# Altium schematic sheet RS232.SchDoc
size A4
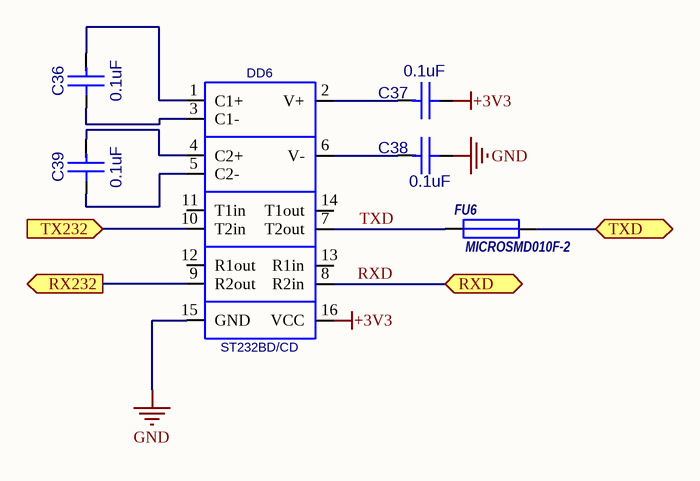
[diagram p0: RS232.SchDoc]

## Parts
C36  0.1uF  [CC0603]
C37  0.1uF  [CC0603]
C38  0.1uF  [CC0603]
C39  0.1uF  [CC0603]
DD6  ST232BD/CD  [SO16_M]
FU6  MICROSMD010F-2  [RC1210]

## Ports
RX232 (out), RXD, TX232 (in), TXD

## Nets
+3V3: C37.1(A) DD6.16(VCC)
GND: C38.1(A) DD6.15(GND)
RX232: DD6.9(R2out) ; port RX232
RXD: DD6.8(R2in) ; port RXD
TX232: DD6.10(T2in) ; port TX232
TXD: DD6.7(T2out) FU6.1
TXD: FU6.2 ; port TXD  [a separate net that carries the same name]
NetC36_1: C36.1(A) DD6.3(C1-)
NetC36_2: C36.2(B) DD6.1(C1+)
NetC37_2: C37.2(B) DD6.2(V+)
NetC38_2: C38.2(B) DD6.6(V-)
NetC39_1: C39.1(A) DD6.5(C2-)
NetC39_2: C39.2(B) DD6.4(C2+)

Not connected (* = marked no-connect by the designer): DD6 11(T1in) 12(R1out) 13(R1in) 14(T1out)

## Library data of the parts
C36-C39 = CC0603: Value: 0.1uF
FU6 = MICROSMD: Value: MICROSMD010F-2
DD6 = ST232BD/CD: Value: *